# EasyEDA Pro project 第十届农装PCB工程.epro, schematic Schematic1
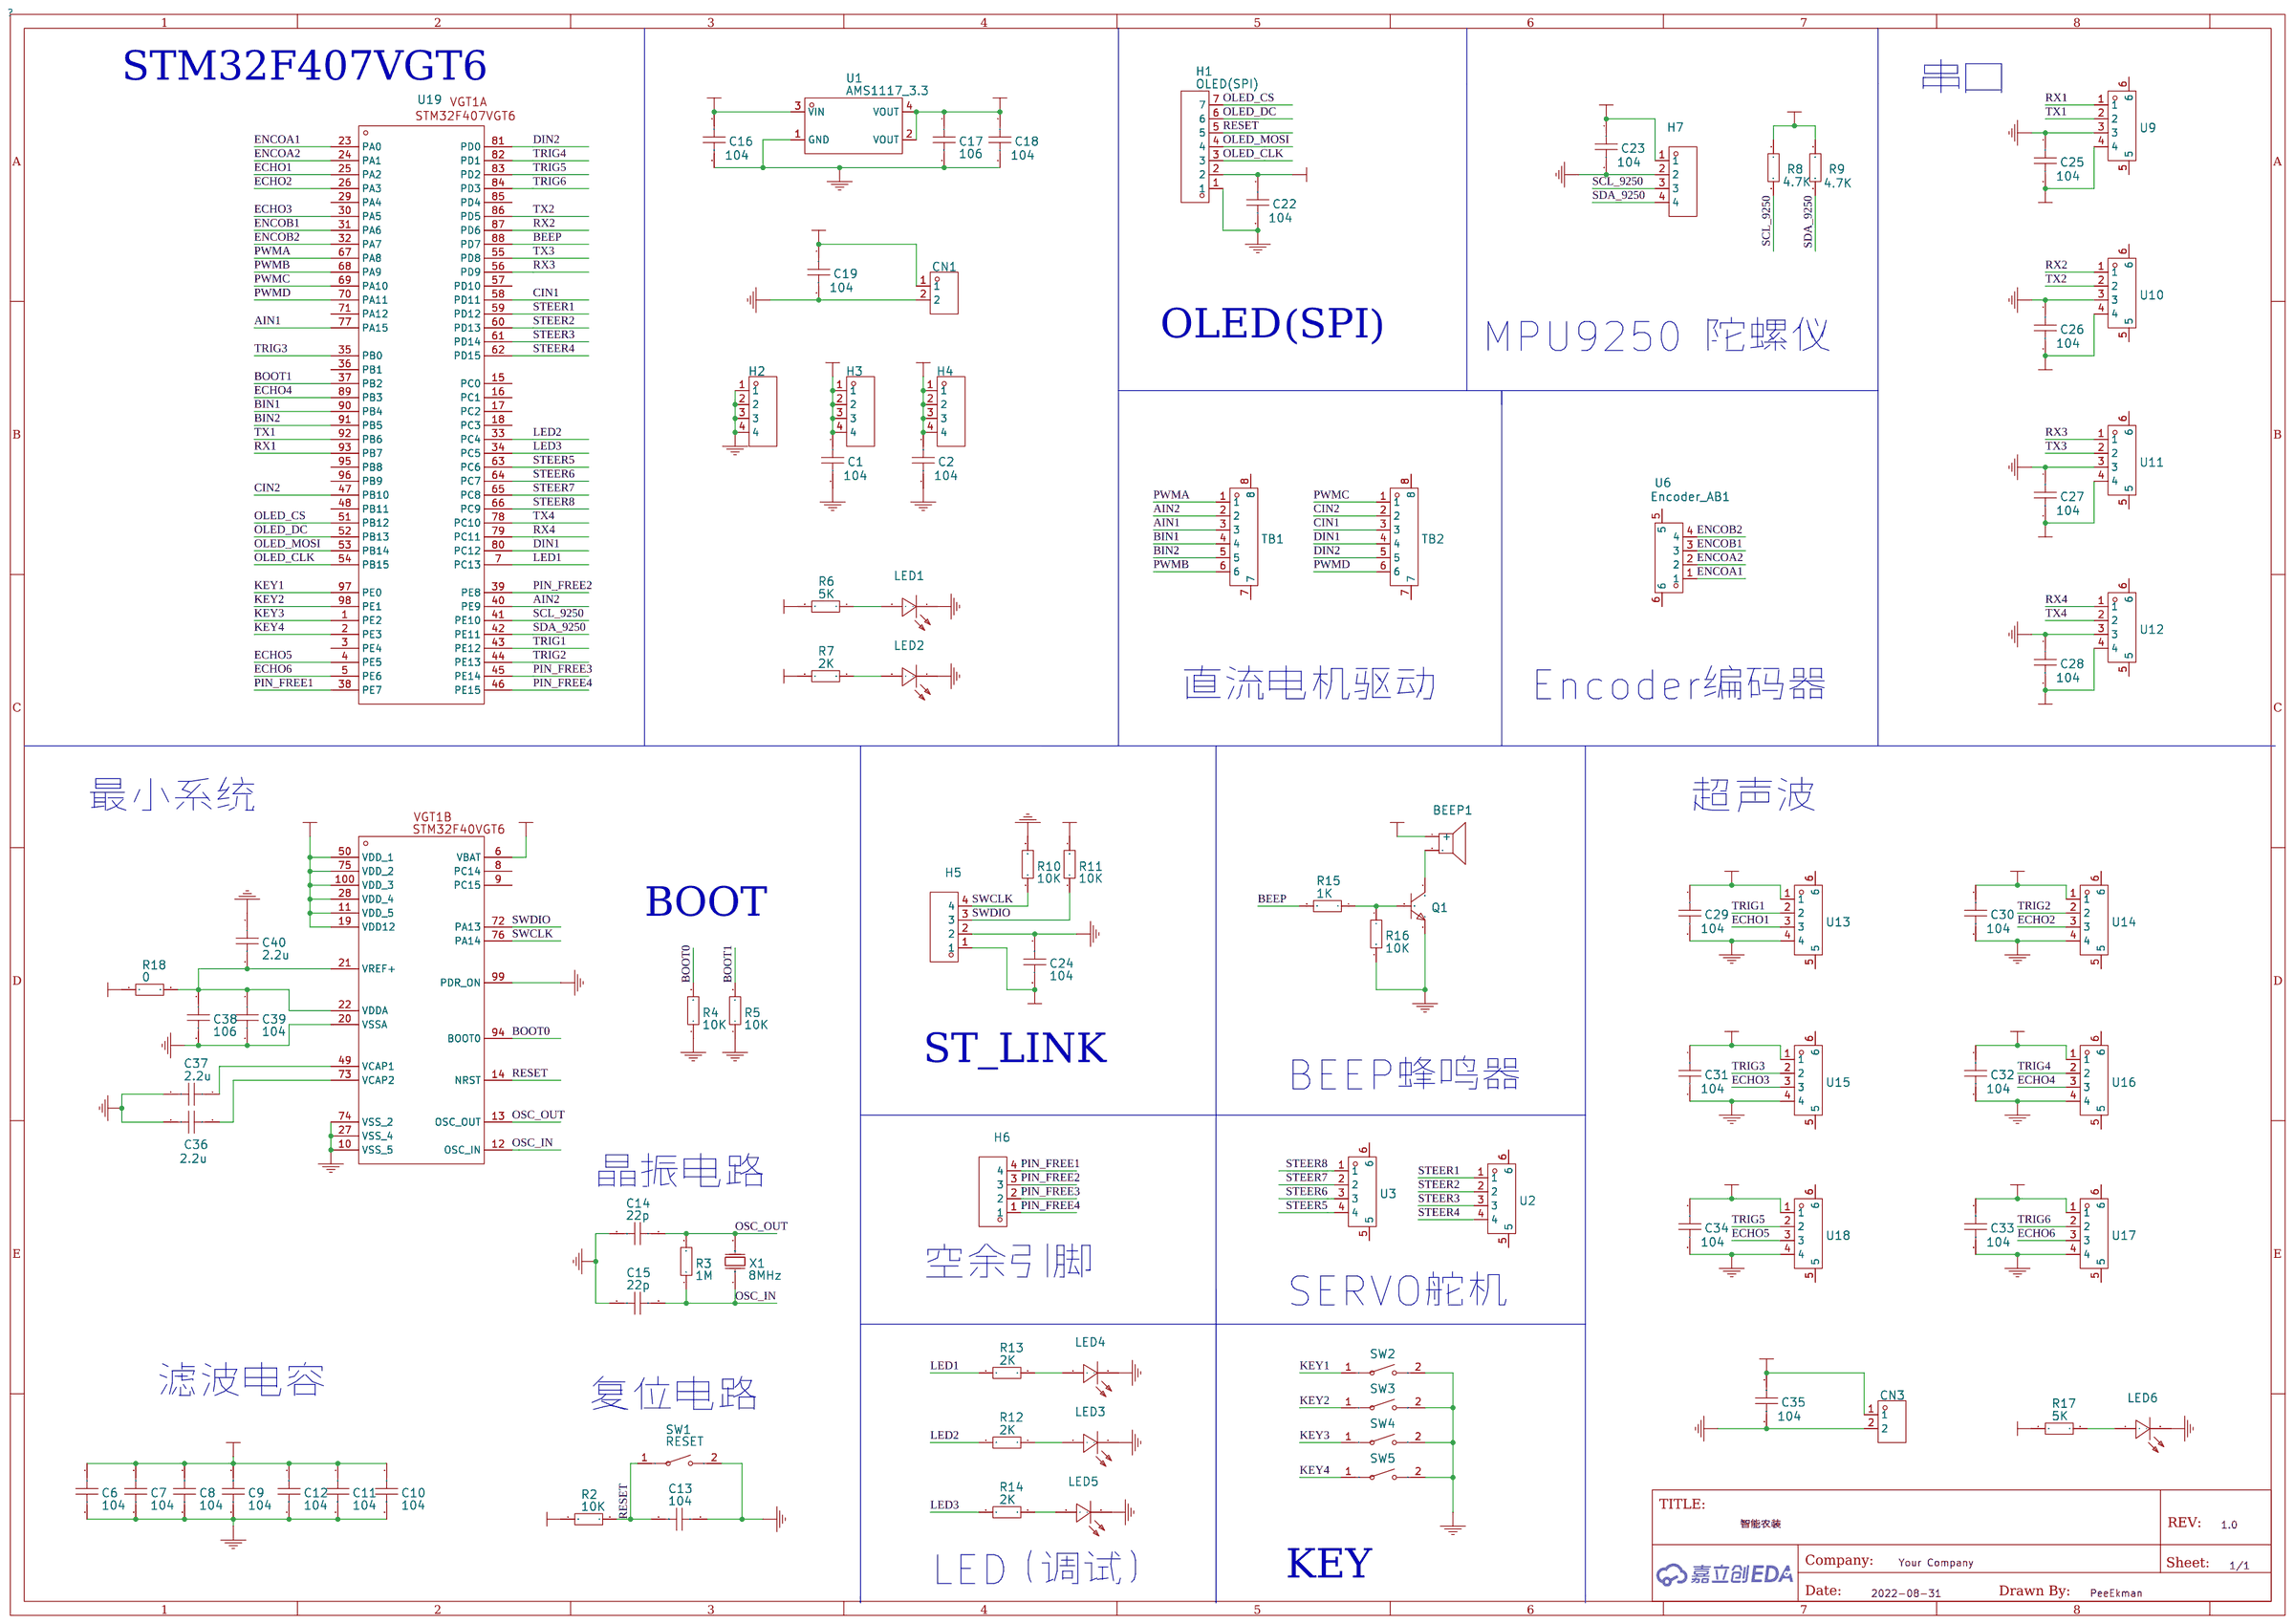
[diagram p0: schematic sheet]

## Parts
BEEP1  TMB12A05
C1  104
C2  104
C6  104
C7  104
C8  104
C9  104
C10  104
C11  104
C12  104
C13  104
C14  22p
C15  22p
C16  104
C17  106
C18  104
C19  104
C22  104
C23  104
C24  104
C25  104
C26  104
C27  104
C28  104
C29  104
C30  104
C31  104
C32  104
C33  104
C34  104
C35  104
C36  2.2u
C37  2.2u
C38  106
C39  104
C40  2.2u
CN1  XY2500R-F-3.81-2P
CN3  XY2500R-F-3.81-2P
H1  OLED(SPI)
H2  826629-4
H3  826629-4
H4  826629-4
H5  826629-4
H6  826629-4
H7  826629-4
LED1  FC-2012HRK-620D
LED2  FC-2012HRK-620D
LED3  FC-2012HRK-620D
LED4  FC-2012HRK-620D
LED5  FC-2012HRK-620D
LED6  FC-2012HRK-620D
Q1  FHT9014Y-ME
R2  10K
R3  1M
R4  10K
R5  10K
R6  5K
R7  2K
R8  4.7K
R9  4.7K
R10  10K
R11  10K
R12  2K
R13  2K
R14  2K
R15  1K
R16  10K
R17  5K
R18  0
SW1  RESET
SW2  RESET
SW3  RESET
SW4  RESET
SW5  RESET
TB1  2.54-6PWT
TB2  2.54-6PWT
U1  AMS1117_3.3
U2  Encoder_AB1
U3  Encoder_AB1
U6  Encoder_AB1
U9  Encoder_AB1
U10  Encoder_AB1
U11  Encoder_AB1
U12  Encoder_AB1
U13  Encoder_AB1
U14  Encoder_AB1
U15  Encoder_AB1
U16  Encoder_AB1
U17  Encoder_AB1
U18  Encoder_AB1
U19  STM32F407VGT6_part
X1  8MHz

## Library data of the parts
BEEP1 = TMB12A05: Supplier: LCSC; Manufacturer: HNDZ; Supplier Part: C96093; JLCPCB Part Class: ExtendedPart; Frequency: 2300Hz
C1 C2 C6-C19 C22-C40 = C0805X100J5GAC7800: Supplier: LCSC; Supplier Part: C9900011191; Manufacturer: null; JLCPCB Part Class: ExtendedPart
CN1 CN3 = XY2500R-F-3.81-2P: Supplier: LCSC; Supplier Part: C880581; Manufacturer: NingboXinlaiyaElec.; JLCPCB Part Class: ExtendedPart
H1 = PZ254V-11-07P: Supplier: LCSC; Supplier Part: C492406; Manufacturer: XFCN; JLCPCB Part Class: ExtendedPart
H2-H7 = 826629-4: Supplier: LCSC; Supplier Part: C590277; Manufacturer: TEConnectivity(美国泰科); JLCPCB Part Class: ExtendedPart
LED1-LED6 = FC-2012HRK-620D: Supplier: LCSC; Manufacturer: NATIONSTAR; Supplier Part: C84256; JLCPCB Part Class: BasicPart
Q1 = FHT9014Y-ME: Supplier: LCSC; Manufacturer: FH; Supplier Part: C88861; JLCPCB Part Class: ExtendedPart
R2-R18 = TR0805D220KP0550Z: Supplier: LCSC; Supplier Part: C2858412; Manufacturer: null; JLCPCB Part Class: ExtendedPart
SW1-SW5 = K2-1107ST-A4SW-06: Supplier: LCSC; Supplier Part: C118141; Manufacturer: RectangularConnectors-Contacts; JLCPCB Part Class: ExtendedPart
TB1 TB2 = 2.54-6PWT: Supplier: LCSC; Supplier Part: C3008583; Manufacturer: SHOUHAN(首韩); link: https://atta.szlcsc.com/upload/public/pdf/source/20220427/ADCB6F8DE9D3C06EE34CC237BEA1B974.pdf; JLCPCB Part Class: ExtendedPart
U1 = AMS1117_3.3
U2 U3 U6 U9-U18 = 2.54-4PWT: Supplier: LCSC; Supplier Part: C3008582; Manufacturer: SHOUHAN(首韩); link: https://atta.szlcsc.com/upload/public/pdf/source/20220427/2E7F20871E2A02EADA0277D3DA8C9F6A.pdf; JLCPCB Part Class: ExtendedPart
U19 = STM32F407VGT6_part
X1 = 7A0801LCSC-DDK2G: Supplier: LCSC; Manufacturer: TXC; Supplier Part: C90881; JLCPCB Part Class: ExtendedPart

## Nets
GND: C1.2 C2.2 C6.2 C7.2 C8.2 C9.2 C10.2 C11.2 C12.2 C13.2 C14.2 C15.1 C16.2 C17.2 C18.2 C19.2 C22.2 C23.2 C24.1 C25.1 C26.1 C27.1 C28.1 C29.2 C30.2 C31.2 C32.2 C33.2 C34.2 C35.2 C36.2 C37.2 C38.2 C39.2 C40.1 CN1.2 CN3.2 H1.1 H2.1 H2.2 H2.3 H2.4 H5.2 H7.2 LED1.1(-) LED2.1(-) LED3.1(-) LED4.1(-) LED5.1(-) LED6.1(-) Q1.2(E) R4.1 R5.1 R10.2 R16.2 SW1.2 SW2.2 SW3.2 SW4.2 SW5.2 U1.1(GND) U9.3 U10.3 U11.3 U12.3 U13.4 U14.4 U15.4 U16.4 U17.4 U18.4 U19.10(VSS_5) U19.20(VSSA) U19.27(VSS_4) U19.74(VSS_2) U19.99(PDR_ON)
VCC3V: C1.1 C6.1 C7.1 C8.1 C9.1 C10.1 C11.1 C12.1 C17.1 C18.1 C22.1 C23.1 C24.2 H1.2 H3.1 H3.2 H3.3 H3.4 H5.1 H7.1 R2.1 R7.2 R8.1 R9.1 R11.2 R18.1 U1.2(VOUT) U1.4(VOUT) U19.6(VBAT) U19.11(VDD_5) U19.19(VDD12) U19.28(VDD_4) U19.50(VDD_1) U19.75(VDD_2) U19.100(VDD_3)
VCC5V: BEEP1.1(+) C2.1 C16.1 C19.1 C25.2 C26.2 C27.2 C28.2 CN1.1 H4.1 H4.2 H4.3 H4.4 R6.2 U1.3(VIN) U9.4 U10.4 U11.4 U12.4
AIN1: TB1.3 U19.77(PA15)
AIN2: TB1.2 U19.40(PE9)
BEEP: R15.2 U19.88(PD7)
BIN1: TB1.4 U19.90(PB4)
BIN2: TB1.5 U19.91(PB5)
BOOT0: R4.2 U19.94(BOOT0)
BOOT1: R5.2 U19.37(PB2)
CIN1: TB2.3 U19.58(PD11)
CIN2: TB2.2 U19.47(PB10)
DIN1: TB2.4 U19.80(PC12)
DIN2: TB2.5 U19.81(PD0)
ECHO1: U13.3 U19.25(PA2)
ECHO2: U14.3 U19.26(PA3)
ECHO3: U15.3 U19.30(PA5)
ECHO4: U16.3 U19.89(PB3)
ECHO5: U18.3 U19.4(PE5)
ECHO6: U17.3 U19.5(PE6)
ENCOA1: U6.1 U19.23(PA0)
ENCOA2: U6.2 U19.24(PA1)
ENCOB1: U6.3 U19.31(PA6)
ENCOB2: U6.4 U19.32(PA7)
KEY1: SW2.1 U19.97(PE0)
KEY2: SW3.1 U19.98(PE1)
KEY3: SW4.1 U19.1(PE2)
KEY4: SW5.1 U19.2(PE3)
LED1: R13.2 U19.7(PC13)
LED2: R12.2 U19.33(PC4)
LED3: R14.2 U19.34(PC5)
OLED_CLK: H1.3 U19.54(PB15)
OLED_CS: H1.7 U19.51(PB12)
OLED_DC: H1.6 U19.52(PB13)
OLED_MOSI: H1.4 U19.53(PB14)
OSC_IN: C15.2 R3.1 U19.12(OSC_IN) X1.1(OSC1)
OSC_OUT: C14.1 R3.2 U19.13(OSC_OUT) X1.2(OSC2)
PIN_FREE1: H6.4 U19.38(PE7)
PIN_FREE2: H6.3 U19.39(PE8)
PIN_FREE3: H6.2 U19.45(PE14)
PIN_FREE4: H6.1 U19.46(PE15)
PWMA: TB1.1 U19.67(PA8)
PWMB: TB1.6 U19.68(PA9)
PWMC: TB2.1 U19.69(PA10)
PWMD: TB2.6 U19.70(PA11)
RESET: C13.1 H1.5 R2.2 SW1.1 U19.14(NRST)
RX1: U9.1 U19.93(PB7)
RX2: U10.1 U19.87(PD6)
RX3: U11.1 U19.56(PD9)
RX4: U12.1 U19.79(PC11)
SCL_9250: H7.3 R8.2 U19.41(PE10)
SDA_9250: H7.4 R9.2 U19.42(PE11)
STEER1: U2.1 U19.59(PD12)
STEER2: U2.2 U19.60(PD13)
STEER3: U2.3 U19.61(PD14)
STEER4: U2.4 U19.62(PD15)
STEER5: U3.4 U19.63(PC6)
STEER6: U3.3 U19.64(PC7)
STEER7: U3.2 U19.65(PC8)
STEER8: U3.1 U19.66(PC9)
SWCLK: H5.4 R10.1 U19.76(PA14)
SWDIO: H5.3 R11.1 U19.72(PA13)
TRIG1: U13.2 U19.43(PE12)
TRIG2: U14.2 U19.44(PE13)
TRIG3: U15.2 U19.35(PB0)
TRIG4: U16.2 U19.82(PD1)
TRIG5: U18.2 U19.83(PD2)
TRIG6: U17.2 U19.84(PD3)
TX1: U9.2 U19.92(PB6)
TX2: U10.2 U19.86(PD5)
TX3: U11.2 U19.55(PD8)
TX4: U12.2 U19.78(PC10)
ULTRA_5V: C29.1 C30.1 C31.1 C32.1 C33.1 C34.1 C35.1 CN3.1 R17.2 U13.1 U14.1 U15.1 U16.1 U17.1 U18.1
BEEP1_2: BEEP1.2 Q1.3(C)
C36_1: C36.1 U19.73(VCAP2)
C37_1: C37.1 U19.49(VCAP1)
LED2_2: LED2.2(+) R7.1
Net-(C38-1): C38.1 C39.1 C40.2 R18.2 U19.21(VREF+) U19.22(VDDA)
Net-(LED1-2): LED1.2(+) R6.1
Net-(LED3-2): LED3.2(+) R12.1
Net-(LED4-2): LED4.2(+) R13.1
Net-(LED5-2): LED5.2(+) R14.1
Net-(LED6-2): LED6.2(+) R17.1
Net-(Q1-1): Q1.1(B) R15.1 R16.1

Not connected (* = marked no-connect by the designer): TB1 7 8; TB2 7 8; U2 5 6; U3 5 6; U6 5 6; U9 5 6; U10 5 6; U11 5 6; U12 5 6; U13 5 6; U14 5 6; U15 5 6; U16 5 6; U17 5 6; U18 5 6; U19 3(PE4) 8(PC14) 9(PC15) 15(PC0) 16(PC1) 17(PC2) 18(PC3) 29(PA4) 36(PB1) 48(PB11) 57(PD10) 71(PA12) 85(PD4) 95(PB8) 96(PB9)

## Notes on the sheet
- STM32F407VGT6
- 串口
- OLED(SPI)
- MPU9250 陀螺仪
- 直流电机驱动
- Encoder编码器
- 最小系统
- 超声波
- BOOT
- ST_LINK
- BEEP蜂鸣器
- 晶振电路
- 空余引脚
- SERVO舵机
- 滤波电容
- 复位电路
- LED（调试）
- KEY
